# Altium project agm_evb.PrjPCB
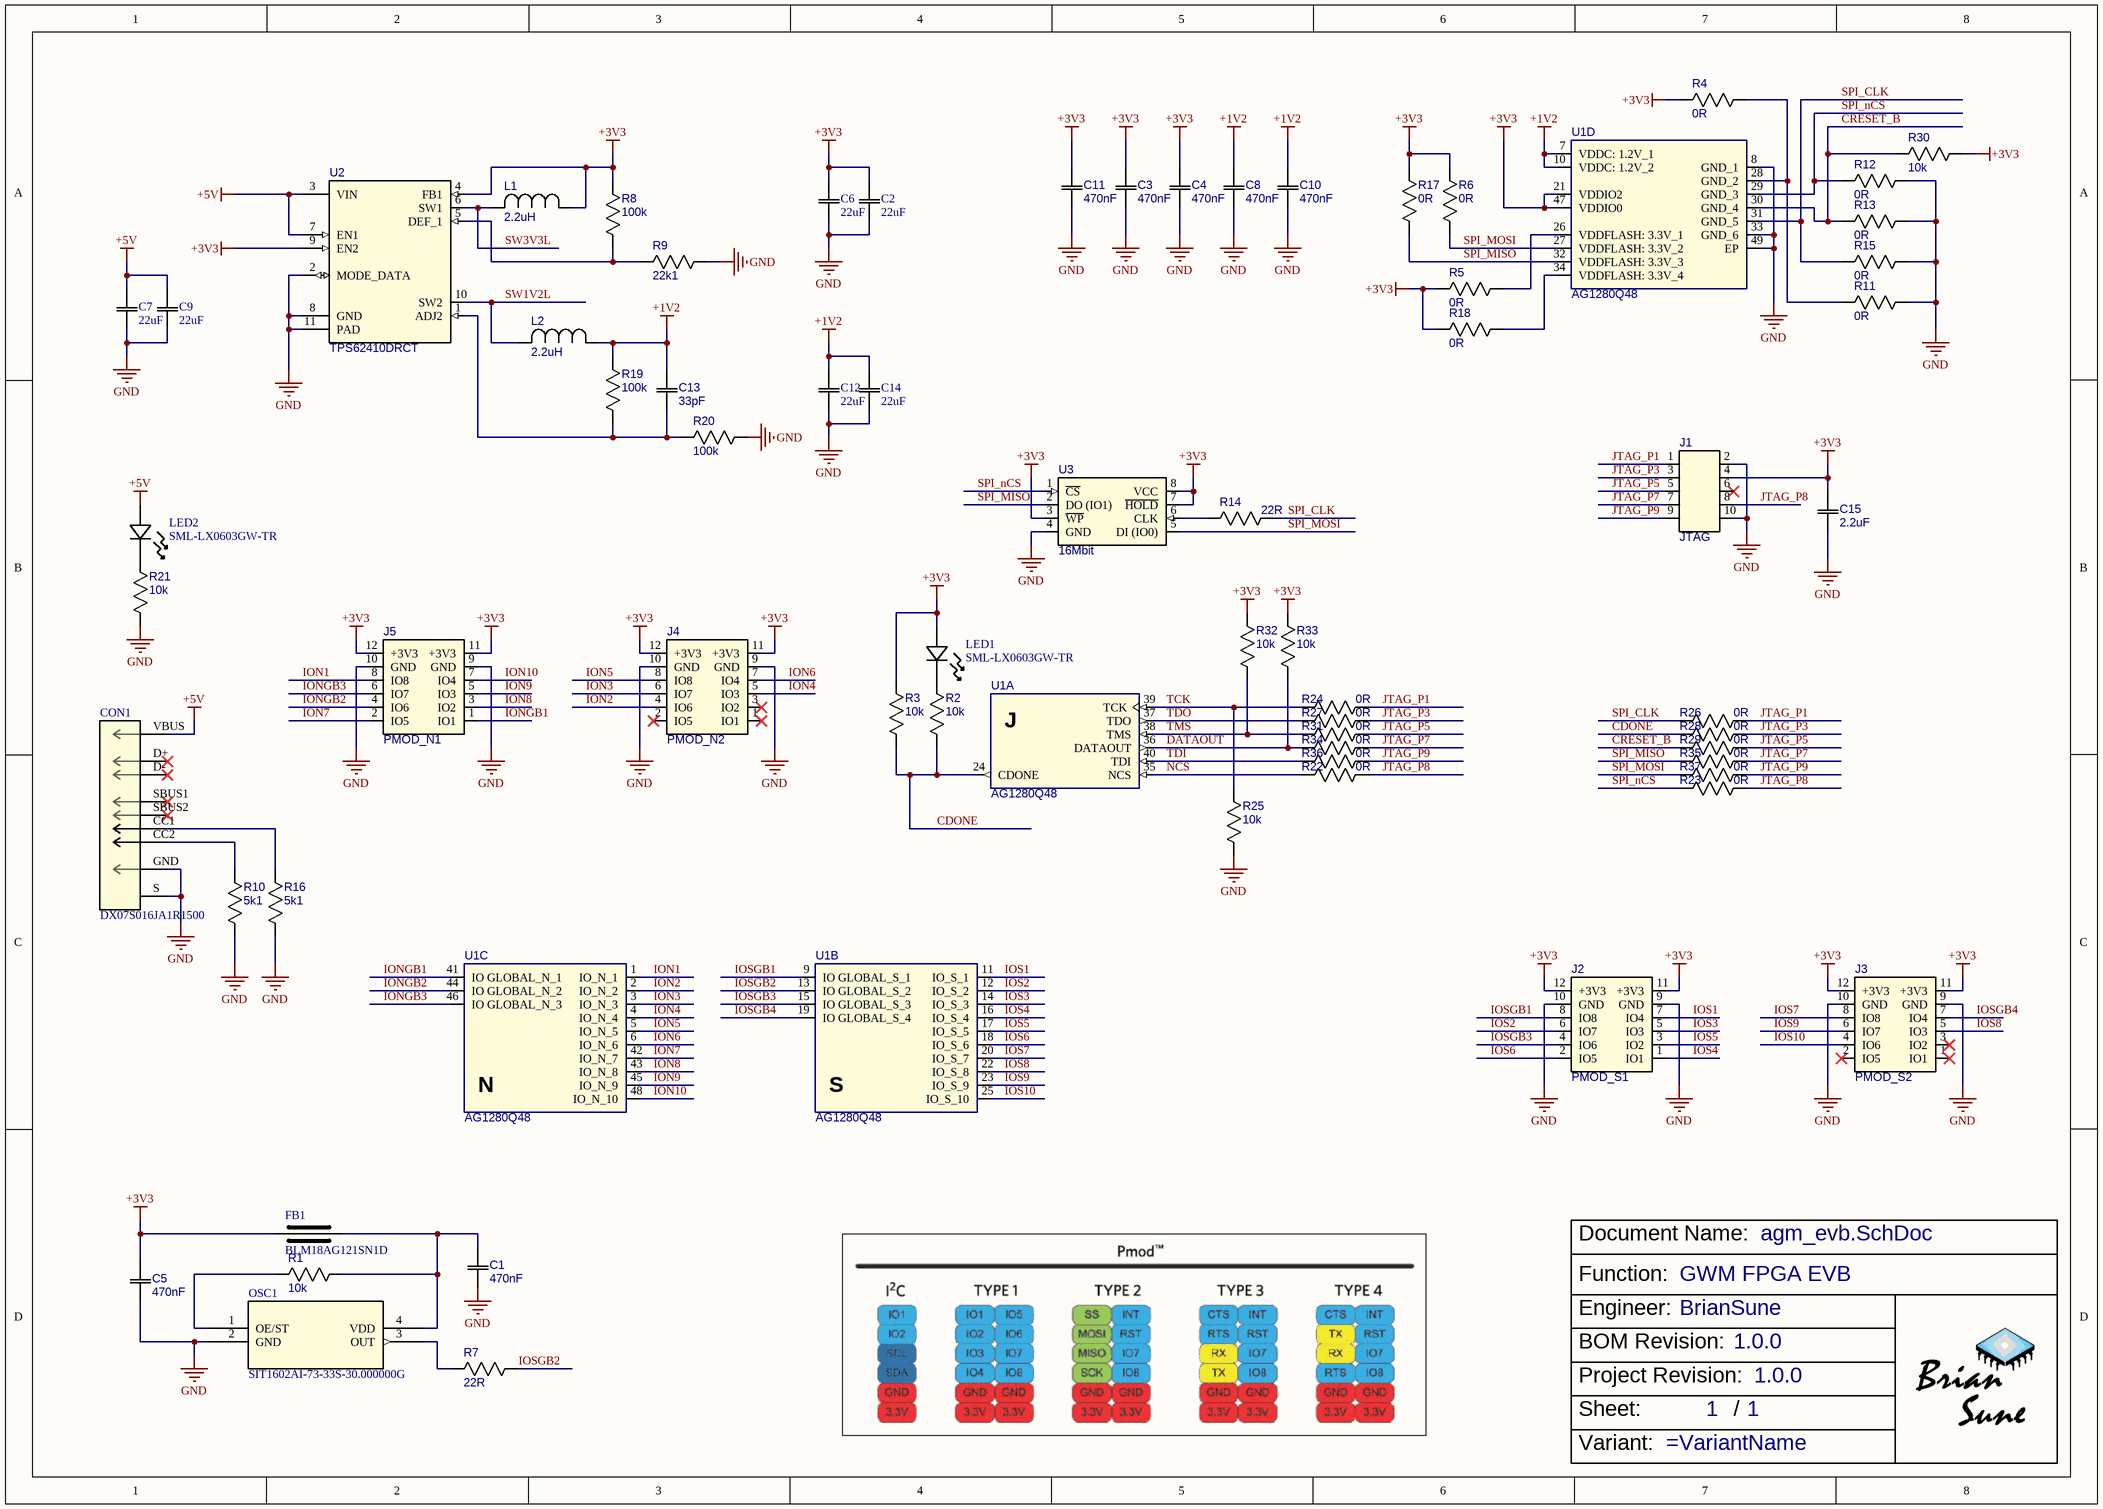
[diagram p0: agm_evb.SchDoc]
BOMRevision: 1.0.0; EngineerName: BrianSune; ProjectRevision: 1.0.0
1 sheet, 68 parts. Net scope: global (net labels, ports and power ports of the same name join across sheets).
Board file: agm_evb.PcbDoc

## Sheet agm_evb.SchDoc
size A3; DocumentNumber: 1; SheetNumber: 1; SheetTotal: 1

### Parts
?  Function: GWM FPGA EVB  (hidden comment: TitleBlock)  (graphical)
C1  470nF  [CAP_CC0402_YAG]
C2  22uF  [CAPC220145_145N_KEM]
C3  470nF  [CAP_CC0402_YAG]
C4  470nF  [CAP_CC0402_YAG]
C5  470nF  [CAP_CC0402_YAG]
C6  22uF  [CAPC220145_145N_KEM]
C7  22uF  [CAPC220145_145N_KEM]
C8  470nF  [CAP_CC0402_YAG]
C9  22uF  [CAPC220145_145N_KEM]
C10  470nF  [CAP_CC0402_YAG]
C11  470nF  [CAP_CC0402_YAG]
C12  22uF  [CAPC220145_145N_KEM]
C13  33pF  [CAP_CC0402_YAG]
C14  22uF  [CAPC220145_145N_KEM]
C15  2.2uF  [CAP_CC0402_YAG]
CON1  DX07S016JA1R1500  [CONN12_016JA1R1500_JAE]
FB1  BLM18AG121SN1D  [IND_BLM18_0603_MUR]
J1  JTAG  [CONN10_G821_20P32X8P7_AMP]
J2  PMOD_S1  [CON12_2X6_P100UM_HDR_TYC]
J3  PMOD_S2  [CON12_2X6_P100UM_HDR_TYC]
J4  PMOD_N2  [CON12_2X6_P100UM_HDR_TYC]
J5  PMOD_N1  [CON12_2X6_P100UM_HDR_TYC]
L1  2.2uH  [1277AS-H-1R0M=P2]
L2  2.2uH  [1277AS-H-1R0M=P2]
LED1  SML-LX0603GW-TR  [LED_SML-LX0603GW-TR_LUM]
LED2  SML-LX0603GW-TR  [LED_SML-LX0603GW-TR_LUM]
OSC1  SIT1602AI-73-33S-30.000000G  [SON4_SIT1602-7_SIT]
R1  10k  [0402_PAN]
R2  10k  [0402_PAN]
R3  10k  [0402_PAN]
R4  0R  [0402_PAN]
R5  0R  [0402_PAN]
R6  0R  [0402_PAN]
R7  22R  [0402_PAN]
R8  100k  [0402_PAN]
R9  22k1  [0402_PAN]
R10  5k1  [0402_PAN]
R11  0R  [0402_PAN]
R12  0R  [0402_PAN]
R13  0R  [0402_PAN]
R14  22R  [0402_PAN]
R15  0R  [0402_PAN]
R16  5k1  [0402_PAN]
R17  0R  [0402_PAN]
R18  0R  [0402_PAN]
R19  100k  [0402_PAN]
R20  100k  [0402_PAN]
R21  10k  [0402_PAN]
R22  0R  [0402_PAN]
R23  0R  [0402_PAN]
R24  0R  [0402_PAN]
R25  10k  [0402_PAN]
R26  0R  [0402_PAN]
R27  0R  [0402_PAN]
R28  0R  [0402_PAN]
R29  0R  [0402_PAN]
R30  10k  [0402_PAN]
R31  0R  [0402_PAN]
R32  10k  [0402_PAN]
R33  10k  [0402_PAN]
R34  0R  [0402_PAN]
R35  0R  [0402_PAN]
R36  0R  [0402_PAN]
R37  0R  [0402_PAN]
U1  AG1280Q48  [QFN48_EP]  (parts A,B,C,D of 4)
U2  TPS62410DRCT  [DRC0010J]
U3  16Mbit  [SOIC_16JLSSIG_WIN]

### Nets
+1V2: C8.2 C10.2 C12.2 C13.2 C14.2 L2.1 R19.2 U1.7(VDDC:_1.2V_1) U1.10(VDDC:_1.2V_2)
+3V3: C2.2 C3.2 C4.2 C5.2 C6.2 C11.2 C15.2 FB1.2 J1.4 J2.11(+3V3) J2.12(+3V3) J3.11(+3V3) J3.12(+3V3) J4.11(+3V3) J4.12(+3V3) J5.11(+3V3) J5.12(+3V3) L1.1 LED1.2 R3.2 R4.2 R5.1 R6.1 R8.2 R17.1 R18.1 R30.2 R32.2 R33.2 U1.21(VDDIO2) U1.47(VDDIO0) U2.4(FB1) U2.9(EN2) U3.3(~{WP}) U3.7(~{HOLD}) U3.8(VCC)
+5V: C7.2 C9.2 CON1.VBUS LED2.2 U2.3(VIN) U2.7(EN1)
GND: C1.1 C2.1 C3.1 C4.1 C5.1 C6.1 C7.1 C8.1 C9.1 C10.1 C11.1 C12.1 C14.1 C15.1 CON1.GND CON1.S(SA) J1.2 J1.10 J2.9(GND) J2.10(GND) J3.9(GND) J3.10(GND) J4.9(GND) J4.10(GND) J5.9(GND) J5.10(GND) OSC1.2(GND) R9.1 R10.1 R11.1 R12.1 R13.1 R15.1 R16.1 R20.1 R21.1 R25.1 U1.8(GND_1) U1.33(GND_6) U1.49(EP) U2.2(MODE_DATA) U2.8(GND) U2.11(PAD) U3.4(GND)
CDONE: R2.1 R3.1 R28.2 U1.24(CDONE)
CRESET_B: R13.2 R29.2 R30.1 U1.30(GND_4)
DATAOUT: R33.1 R34.2 U1.36(DATAOUT)
ION1: J5.8(IO8) U1.1(IO_N_1)
ION2: J4.4(IO6) U1.2(IO_N_2)
ION3: J4.6(IO7) U1.3(IO_N_3)
ION4: J4.5(IO3) U1.4(IO_N_4)
ION5: J4.8(IO8) U1.5(IO_N_5)
ION6: J4.7(IO4) U1.6(IO_N_6)
ION7: J5.2(IO5) U1.42(IO_N_7)
ION8: J5.3(IO2) U1.43(IO_N_8)
ION9: J5.5(IO3) U1.45(IO_N_9)
ION10: J5.7(IO4) U1.48(IO_N_10)
IONGB1: J5.1(IO1) U1.41(IO_GLOBAL_N_1)
IONGB2: J5.4(IO6) U1.44(IO_GLOBAL_N_2)
IONGB3: J5.6(IO7) U1.46(IO_GLOBAL_N_3)
IOS1: J2.7(IO4) U1.11(IO_S_1)
IOS2: J2.6(IO7) U1.12(IO_S_2)
IOS3: J2.5(IO3) U1.14(IO_S_3)
IOS4: J2.1(IO1) U1.16(IO_S_4)
IOS5: J2.3(IO2) U1.17(IO_S_5)
IOS6: J2.2(IO5) U1.18(IO_S_6)
IOS7: J3.8(IO8) U1.20(IO_S_7)
IOS8: J3.5(IO3) U1.22(IO_S_8)
IOS9: J3.6(IO7) U1.23(IO_S_9)
IOS10: J3.4(IO6) U1.25(IO_S_10)
IOSGB1: J2.8(IO8) U1.9(IO_GLOBAL_S_1)
IOSGB2: R7.1 U1.13(IO_GLOBAL_S_2)
IOSGB3: J2.4(IO6) U1.15(IO_GLOBAL_S_3)
IOSGB4: J3.7(IO4) U1.19(IO_GLOBAL_S_4)
JTAG_P1: J1.1 R24.1 R26.1
JTAG_P3: J1.3 R27.1 R28.1
JTAG_P5: J1.5 R29.1 R31.1
JTAG_P7: J1.7 R34.1 R35.1
JTAG_P8: J1.8 R22.1 R23.1
JTAG_P9: J1.9 R36.1 R37.1
NCS: R22.2 U1.35(NCS)
SPI_CLK: R14.1 R15.2 R26.2 U1.31(GND_5)
SPI_MISO: R17.2 R35.2 U1.32(VDDFLASH:_3.3V_3) U3.2(DO_(IO1))
SPI_MOSI: R6.2 R37.2 U1.27(VDDFLASH:_3.3V_2) U3.5(DI_(IO0))
SPI_nCS: R12.2 R23.2 U1.29(GND_3) U3.1(~{CS})
SW1V2L: L2.2 U2.10(SW2)
SW3V3L: L1.2 U2.6(SW1)
TCK: R24.2 R25.2 U1.39(TCK)
TDI: R36.2 U1.40(TDI)
TDO: R27.2 U1.37(TDO)
TMS: R31.2 R32.1 U1.38(TMS)
NetC1_2: C1.2 FB1.1 OSC1.4(VDD) R1.1
NetC13_1: C13.1 R19.1 R20.2 U2.1(ADJ2)
NetCON1_CC1: CON1.CC1 R16.2
NetCON1_CC2: CON1.CC2 R10.2
NetLED1_1: LED1.1 R2.2
NetLED2_1: LED2.1 R21.2
NetOSC1_1: OSC1.1(OE/ST) R1.2
NetOSC1_3: OSC1.3(OUT) R7.2
NetR4_1: R4.1 R11.2 U1.28(GND_2)
NetR5_2: R5.2 U1.26(VDDFLASH:_3.3V_1)
NetR8_1: R8.1 R9.2 U2.5(DEF_1)
NetR14_2: R14.2 U3.6(CLK)
NetR18_2: R18.2 U1.34(VDDFLASH:_3.3V_4)

Not connected (* = marked no-connect by the designer): CON1 D+* D-(D_)* SBUS1* SBUS2*; J1 6*; J3 1(IO1)* 2(IO5)* 3(IO2)*; J4 1(IO1)* 2(IO5)* 3(IO2)*

### Notes on the sheet
- (in symbol AG1280Q48, part A) J
- (in symbol AG1280Q48, part B) S
- (in symbol AG1280Q48, part C) N
- (in symbol TitleBlock) Document Name:; Function:; Engineer:; BOM Revision:; Project Revision:; Sheet:; /; Variant:

### Library data of the parts
C1 C3-C5 C8 C10 C11 = GRM155R71A474KE01D: GRM155R71A474KE01D / Multilayer Ceramic Capacitors MLCC - SMD/SMT PLEASE SEE MURATA'S SUGGESTED ALTERNATE GRM155R61H474ME11D; Mfr. No: GRM155R6YA474ME01D; Mfr.: Murata Electronics; ComponentLink1Description: mouser; ComponentLink1URL: https://www.mouser.hk/ProductDetail/Murata-Electronics/GRM155R6YA474ME01D?qs=sGAEpiMZZMsh%252B1woXyUXj0ipSi1CtQgVFCJAGxNeTMI%3D
C2 C6 C7 C9 C12 C14 = C0805C106M9RACTU: No Description Available; Mfr_Name: Kemet; Type: DEV; Copyright: Copyright (C) 2022 Ultra Librarian. All rights reserved.; Manufacturer_Part_Number: C0805C106M9RACTU; RefDes: RefDes
C13 = GCM1555C1H330JA16J: Mfr.: Murata Electronics; ComponentLink1Description: mouser; ComponentLink1URL: https://www.mouser.hk/ProductDetail/Murata-Electronics/GCM1555C1H330JA16J?qs=hNud%2FORuBR35r9xfgxU5AA%3D%3D; Mfr. No: GCM1555C1H330JA16J
C15 = GRM155R6YA225ME11D: GRM155R6YA225ME11D / Multilayer Ceramic Capacitors MLCC - SMD/SMT 2.2UF 35V 20% 0402; Mfr.: Murata Electronics; ComponentLink1Description: mouser; ComponentLink1URL: https://www.mouser.hk/ProductDetail/Murata-Electronics/GRM155R6YA225ME11D?qs=84nSAGdh8NX%252BZ1uZ5doDKg%3D%3D; Mfr. No: GRM155R6YA225ME11D
CON1 = DX07S016JA1R1500: No Description Available; Built_By: EMA_Matt; Vendor: JAE Electronics; SourceLibrary: JAE_Electronics_2020-03-30; Datasheet: https://www.digikey.com/product-detail/en/DX07S016JA1R1500/670-DX07S016JA1R1500CT-ND/11586676?utm_campaign=buynow&WT.z_cid=ref_octopart_dkc_buynow&utm_medium=aggregator&curr=usd&site=us&utm_source=octopart; Manufacturer_Part_Number: DX07S016JA1R1500; Copyright: Copyright (C) 2018 Accelerated Designs. All rights reserved; RefDes: RefDes; Type: DEV
FB1 = BLM18AG121SN1D: No Description Available; Mfr_Name: Murata; Type: DEV; Copyright: Copyright (C) 2022 Ultra Librarian. All rights reserved.; Manufacturer_Part_Number: BLM18AG121SN1D; RefDes: RefDes
J1 = G821EU210AGM00Y: G821EU210AGM00Y / Headers & Wire Housings Box Header 2.54mm*2.54mm Pitch STR DIP, 2x5Pin, G/F, NY6T, TAIL=3.0mm, Color-Black, T&R, WO/CAP; Mfr.: Amphenol ICC; Mfr. No: G821EU210AGM00Y; ComponentLink1Description: mouser; ComponentLink1URL: https://www.mouser.hk/ProductDetail/Amphenol-Commercial-Products/G821EU210AGL00RS?qs=PzGy0jfpSMsw%252Bc01gC9TMg%3D%3D
J2-J5 = 10129381-912001BLF: 10129381-912001BLF / Headers & Wire Housings ECONOSTIK HEADER DR VT TH 2X6; Mfr. No: 826942-6; Mfr.: 10129381-912001BLF; ComponentLink1Description: mouser; ComponentLink1URL: https://www.mouser.hk/ProductDetail/Amphenol-FCI/10129381-912001BLF?qs=0lQeLiL1qybH5JyuikDxjQ%3D%3D
L1 L2 = 1277AS-H-2R2M=P2: 1277AS-H-2R2M=P2 / SMD 2.2 UH 20%; Mfr_Name: Murata; Manufacturer_Part_Number: 1277AS-H-2R2M=P2; ComponentLink1Description: mouser; ComponentLink1URL: https://www.mouser.hk/ProductDetail/Murata-Electronics/1277AS-H-2R2M%3DP2?qs=4tuKoHGzn104DGWhEjLPYA%3D%3D
LED1 LED2 = SML-LX0603GW-TR: No Description Available; Vendor: Lumex; Built_By: EMA_Cory; SourceLibrary: Lumex_2020-09-08; Type: DEV; Datasheet: https://www.lumex.com/spec/SML-LX0603GW-TR.pdf; Manufacturer_Part_Number: SML-LX0603GW-TR; Copyright: Copyright (C) 2018 Accelerated Designs. All rights reserved; RefDes: RefDes
OSC1 = SIT1602AI-73-33S-30.000000G: No Description Available; Built_By: EMA_Justin; Vendor: SiTime; SourceLibrary: SiTime_2019-03-28_19; Copyright: Copyright (C) 2018 Accelerated Designs. All rights reserved; Manufacturer_Part_Number: SIT1602AI-73-33S-30.000000G; RefDes: RefDes; Type: DEV
R1-R3 R21 R25 R30 R32 R33 = RT0402FRE0710KL: RT0402FRE0710KL / SMD 1/16W 10K ohm 1% 50ppm; Mfr.: YAGEO; ComponentLink1Description: mouser; ComponentLink1URL: https://www.mouser.hk/ProductDetail/YAGEO/RT0402FRE0710KL?qs=BXCcY9r%252B08Amup7nMFKW1g%3D%3D; Mfr. No: RT0402FRE0710KL
R4-R6 R11-R13 R15 R17 R18 R22-R24 R26-R29 R31 R34-R37 = RC0402FR-070RL: RC0402FR-070RL / Thick Film Resistors - SMD 0 Ohms 62.5mW 0402 1%; Mfr.: YAGEO; ComponentLink1Description: mouser; ComponentLink1URL: https://www.mouser.hk/ProductDetail/YAGEO/RC0402FR-070RL?qs=sxZXDnvRBEhfSy4CZGX2ww%3D%3D; Mfr. No: RC0402FR-070RL
R7 R14 = RT0402FRE0722RL: RT0402FRE0722RL / SMD 1/16W 22 ohm 1% 50ppm; Mfr.: YAGEO; ComponentLink1Description: mouser; ComponentLink1URL: https://www.mouser.hk/ProductDetail/YAGEO/RT0402FRE0722RL?qs=BXCcY9r%252B08AR6tDwkCsBaQ%3D%3D; Mfr. No: RT0402FRE0722RL
R8 R19 R20 = RT0402FRE07100KL: RT0402FRE07100KL / SMD 1/16W 100K ohm 1% 50ppm; Mfr.: YAGEO; ComponentLink1Description: mouser; ComponentLink1URL: https://www.mouser.hk/ProductDetail/YAGEO/RT0402FRE07100KL?qs=BXCcY9r%252B08CxTvf5JB1kiw%3D%3D; Mfr. No: RT0402FRE07100KL
R9 = RT0402FRE0722K1L: RT0402FRE0722K1L / SMD 1/16W 22.1K ohm 1% 50ppm; Mfr.: YAGEO; ComponentLink1Description: mouser; ComponentLink1URL: https://www.mouser.hk/ProductDetail/YAGEO/RT0402FRE0722K1L?qs=gY0y7AQI9SNvNyhDoNY8tg%3D%3D; Mfr. No: RT0402FRE0722K1L
R10 R16 = RT0402FRE075K1L: RT0402FRE075K1L / Thin Film Resistors - SMD 5.1K OHM 1% 50PPM 1/16W; Mfr.: YAGEO; ComponentLink1Description: mouser; ComponentLink1URL: https://www.mouser.hk/ProductDetail/YAGEO/RT0402FRE075K1L?qs=gY0y7AQI9SP4FZkrbB0g%252BA%3D%3D; Mfr. No: RT0402FRE075K1L
U1 = AG1280Q48: AG1280Q48 / Replacement EPM1270; Mfr.: AGM; ComponentLink1Description: taobao; ComponentLink1URL: https://item.taobao.com/item.htm?spm=a1z10.3-c-s.w4002-24461620540.9.b1725d4eQU1zMx&id=661396416086; Mfr. No: AG1280Q48
U2 = TPS62410DRCT: TPS62410DRCT / 2.25MHZ 2x800mA Dual Step-Down; Mfr_Name: Texas Instruments; Manufacturer_Part_Number: TPS62410DRCT; ComponentLink1Description: mouser; ComponentLink1URL: https://www.mouser.hk/ProductDetail/Texas-Instruments/TPS62410DRCR?qs=e2UXF4UEWQ0ltUOqd4EYmg%3D%3D
U3 = W25Q16JLSSIG: W25Q16JLSSIG / NOR Flash spiFlash, 16M-bit, 4Kb Uniform Sector; Mfr.: Winbond; Mfr. No: W25Q16JLSSIG; ComponentLink1Description: mouser; ComponentLink1URL: https://www.mouser.hk/ProductDetail/Winbond/W25Q16JLSSIG?qs=qSfuJ%252Bfl%2Fd6Xi57nHYg5gQ%3D%3D

## Assembly variants
AG1KLPQ48: not fitted R15 R16 R17 R18 R19 R21 R22 R23 R23 R24 R25 R26 R27 R28 R29 R36 R37 TP1 TP2 TP3 TP4 TP5 TP6
AG1280Q48: not fitted R20 R22 R30 R31 R32 R33 R34 R35 TP1 TP2 TP3 TP4 TP5 TP6